# Altium schematic sheet Speaker-Amplifier.SchDoc
size A; SheetNumber: 9; SheetTotal: 9
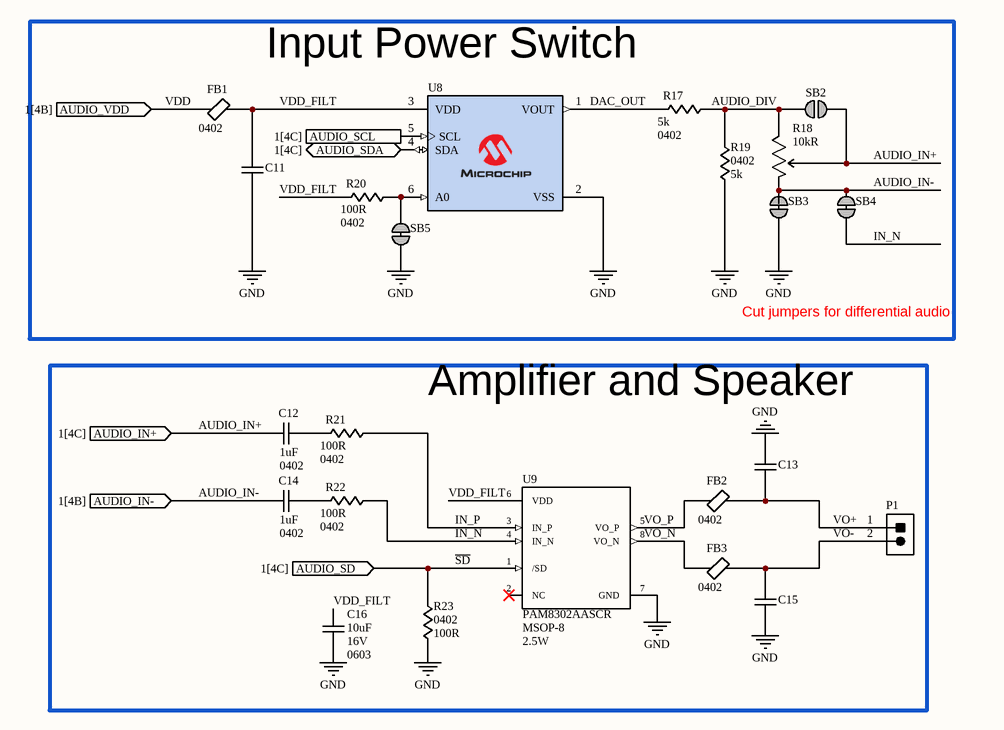
[diagram p0: Speaker-Amplifier.SchDoc]

## Parts
C11  CAP-SMD-0402  [PCB-CAP-SMD-0402]  (value not drawn)
C12  value 1uF  Voltage: 0402  [PCB-CAP-SMD-0402]  (hidden comment: CAP-SMD-0402)
C13  CAP-SMD-0402  [PCB-CAP-SMD-0402]  (value not drawn)
C14  value 1uF  Voltage: 0402  [PCB-CAP-SMD-0402]  (hidden comment: CAP-SMD-0402)
C15  CAP-SMD-0402  [PCB-CAP-SMD-0402]  (value not drawn)
C16  value 10uF  Voltage: 16V  Footprint: 0603  [PCB-CAP-SMD-0603]  (hidden comment: CAP-SMD-0603)
FB1  Footprint: 0402  [PCB-SMD-FERRITE-0402]  (hidden comment: FERRITE-SMD-GENERIC-0402)
FB2  Footprint: 0402  [PCB-SMD-FERRITE-0402]  (hidden comment: FERRITE-SMD-GENERIC-0402)
FB3  Footprint: 0402  [PCB-SMD-FERRITE-0402]  (hidden comment: FERRITE-SMD-GENERIC-0402)
P1  CONN-PICOBLADE-SMD-1.25MM-2PIN-53261-0271  [PCB-PICOBLADE-2PIN-1.25MM]  (value not drawn)
R17  value 5k  Footprint: 0402  [PCB-RES-SMA-0402]  (hidden comment: RES-SMD-0402)
R18  value 10kR  [PCB-FP-3352T-MFG]  (hidden comment: POT-THUMB-9MM-3352T-1-103LF)
R19  value 5k  Footprint: 0402  [PCB-RES-SMA-0402]  (hidden comment: RES-SMD-0402)
R20  value 100R  Footprint: 0402  [PCB-RES-SMA-0402]  (hidden comment: RES-SMD-0402)
R21  value 100R  Footprint: 0402  [PCB-RES-SMA-0402]  (hidden comment: RES-SMD-0402)
R22  value 100R  Footprint: 0402  [PCB-RES-SMA-0402]  (hidden comment: RES-SMD-0402)
R23  value 100R  Footprint: 0402  [PCB-RES-SMA-0402]  (hidden comment: RES-SMD-0402)
SB2  SB-OPEN-NO-PASTE  [PCB-SOLDERJUMPER-NOPASTE]  (value not drawn)  (no BOM)
SB3  SB-CLOSED-NO-PASTE  [-SOLDERJUMPER-CLOSEDWIRE]  (value not drawn)  (net tie, no BOM)
SB4  SB-CLOSED-NO-PASTE  [-SOLDERJUMPER-CLOSEDWIRE]  (value not drawn)  (net tie, no BOM)
SB5  SB-CLOSED-NO-PASTE  [-SOLDERJUMPER-CLOSEDWIRE]  (value not drawn)  (net tie, no BOM)
U8  IC-DAC-12BIT-1CH-I2C-MCP4725A0T-E/CH  [PCB-MCP4725-MSOP-10-3X3MM]  (value not drawn)
U9  Case/Package: MSOP-8  Output Power: 2.5W  Part Number: PAM8302AASCR  [PCB-MSOP-8-.65MM]  (hidden comment: IC-AUDIO-AMP-2.5W-PAM8302AASCR)

## Blocks framed on the sheet
Input Power Switch: C11 FB1 R17-R20 SB2-SB5 U8
Amplifier and Speaker: C12-C16 FB2 FB3 P1 R21-R23 U9

## Ports
AUDIO_IN+ (in, see 1[4C]), AUDIO_IN- (in, see 1[4B]), AUDIO_SCL (in, see 1[4C]), AUDIO_SD (in, see 1[4C]), AUDIO_SDA (bidir, see 1[4C]), AUDIO_VDD (in, see 1[4B])

## Nets
GND: C11.1 C13.2 C15.1 C16.1 R19.2 R23.1 SB3.2 SB5.2 U8.2(VSS) U9.7(GND)
~{SD}: R23.2 U9.1(/SD) ; port AUDIO_SD
AUDIO_DIV: R17.2 R18.1(CCW) R19.1 SB2.2
AUDIO_IN+: C12.1 R18.2(WIPER) SB2.1 ; port AUDIO_IN+
AUDIO_IN-: C14.1 R18.3(CW) SB3.1 SB4.1 ; port AUDIO_IN-
AUDIO_SCL: U8.5(SCL) ; port AUDIO_SCL
AUDIO_SDA: U8.4(SDA) ; port AUDIO_SDA
DAC_OUT: R17.1 U8.1(VOUT)
IN_N: R22.2 SB4.2 U9.4(IN_N)
IN_P: R21.2 U9.3(IN_P)
VDD: FB1.1 ; port AUDIO_VDD
VDD_FILT: C11.2 C16.2 FB1.2 R20.1 U8.3(VDD) U9.6(VDD)
VO+: C13.1 FB2.2 P1.1
VO-: C15.2 FB3.2 P1.2
VO_N: FB3.1 U9.8(VO_N)
VO_P: FB2.1 U9.5(VO_P)
NetC12_2: C12.2 R21.1
NetC14_2: C14.2 R22.1
NetP1_MP1: P1.MP1 P1.MP2
NetR20_2: R20.2 SB5.1 U8.6(A0)

Not connected (* = marked no-connect by the designer): U9 2(NC)*

## Notes on the sheet
- Cut jumpers for differential audio

## Library data of the parts
C11-C15 = CMP-00005-8: Generic (no part number) 0402 surface mount capacitor
C16 = CMP-00006-5: Generic (no part number) 0603 surface mount capacitor
FB1-FB3 = CMP-00058-1: Generic (no part number) 0402 ferrite bead
P1 = CMP-00092-1: 1.25mm Pitch PicoBlade™ Header, Surface Mount, Right Angle, Lead-Free, 2 Circuits; Current Rating: 1A; Voltage Rating (DC): 125V; Glow Wire Compliant: Non-compliant; Number of Contacts: 2; Insulation Resistance: 100MR; Gender: Male; Contact Resistance: 20mR; Orientation: Right Angle; Color: Natural; Min Operating Temperature: -40°C; Housing Color: Natural; Max Operating Temperature: 85°C; Fastening Type: Detent; Packaging: Tape and Reel; Series: PicoBlade; Contact Material: Bronze,Tin; Number of Rows: 1; Radiation Hardening: No; Flammability Rating: UL94 V-0; Voltage Rating (AC): 125V; Contact Shape: Rectangular; Insulation Material: Nylon; Lead Pitch: 1.25mm; Housing Material: Nylon; Depth: 5.2mm; Working Voltage: 125V; Connector Type: Header; Contact Plating: Tin; Insulation Color: Natural; Number of Circuits: 2; Contact Finish - Mating: TIN; Termination: Solder; Reach SVHC Compliant: Unknown; Contact Type: Blade Pin; RoHS Compliant: Yes; Mounting Technology: Surface Mount; Package Quantity: 1000; Lead Free: Lead Free; Voltage Rating: 125V; Number of Positions: 2; Pitch: 1.25mm
R17 R19-R23 = CMP-00001-3: Generic (no part number) 0402 surface mount resistor
R18 = CMP-00093-1: Trimmer Potentiometer 10k Ohm 20% 1/2 Watt 1 Turn Pin Through Hole; Max Power Dissipation: 500mW; Number of Turns: 1; Temperature Coefficient: 100ppm/°C; Voltage Rating: 250V; Diameter: 8.89mm; Power Rating: 500mW; Min Operating Temperature: -55°C; Resistance Tolerance: 20%; Mounting Technology: Through Hole,PCB; Color: Black; Technology: CERMET; Termination: Pin; Lead Free: Lead Free; Series: Trimpot® 3352 - Open Frame; Max Operating Temperature: 125°C; Resistor Type: Cermet; Length: 8.89mm; Width: 8.89mm; Packaging: Bag; Military Standard: Not; Reach SVHC Compliant: No; Radiation Hardening: No; Tolerance: 20%; Weight: 0.01oz; Height: 3.81mm; Taper: Linear; RoHS Compliant: Yes; Depth: 9.53mm
SB2 = CMP-090-000003-4: Solder bridge, normally open, no solder paste.
SB3-SB5 = CMP-090-000001-3: Solder bridge, normally closed
U8 = CMP-00009-5: IC DAC 12BIT W/I2C SOT23A-6; Number of Bits: 12; Differential Output: No; Number of D/A Converters: 1; Resolution: 12b; Input Offset Voltage (Vos): 1.1mV; Settling Time: 6us; Input Type: SERIAL; Integral Nonlinearity (INL): 14.5LSB; Supply Current: 210uA; Output Polarity: Unipolar; Min Supply Voltage: 2.7V; Max Supply Voltage: 5.5V; Interface: I2C,Serial,2-Wire; Output Type: Voltage; RoHS Compliant: Yes; Mounting Technology: Surface Mount; Min Operating Temperature: -40°C; Height: 1.3mm; Max Operating Temperature: 125°C; Package Quantity: 3000; Termination: SMD/SMT; Number of Channels: 1; Series: -; Radiation Hardening: No; Number of Outputs: 1; Lead Free: Lead Free; Width: 1.8mm; Pins: 6; Number of Converters: 1; Packaging: Tape and Reel; Reach SVHC Compliant: No; Number of DAC Channels: 1; Case/Package: SOT-23-6; Length: 3.1mm
U9 = CMP-00047-2: IC AMP AUDIO 2.5W CLASS D 8MSOP; Supply Current: 8mA; Operating Supply Current: 4mA; Number of Channels: 1; Min Supply Voltage: 2V; Supply Type: Single; Max Supply Voltage: 5.5V; Power Supply Rejection Ratio (PSRR): 50dB; Voltage Gain: 24dB; Mounting Technology: Surface Mount; Package Quantity: 2500; Series: -; Weight: 0.004938oz; Pins: 8; Max Output Power: 2.5W; RoHS Compliant: Yes; Packaging: Tape and Reel; Radiation Hardening: No; Lead Free: Lead Free; Max Operating Temperature: 85°C; Min Operating Temperature: -40°C